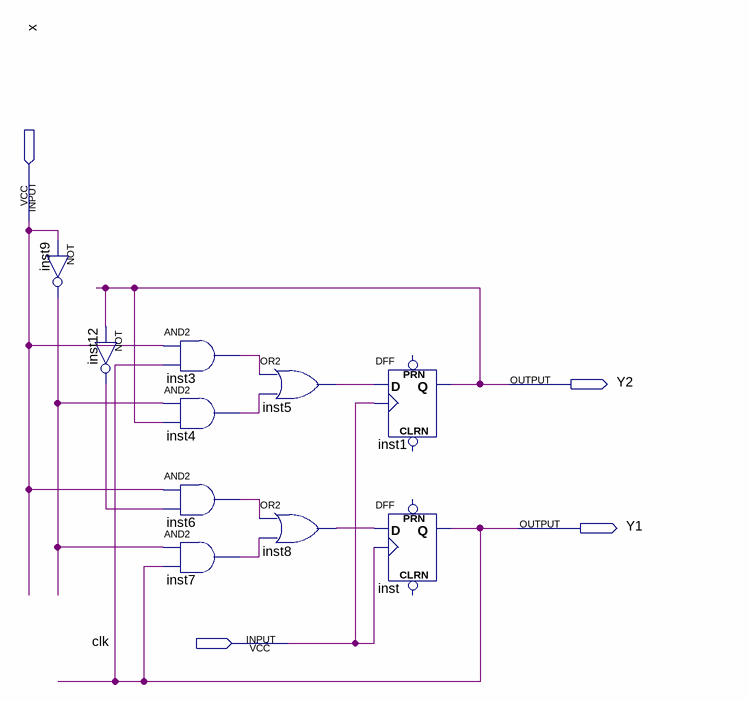
[diagram p0: schematic sheet]
// Quartus schematic Test001.bdf as structural Verilog: 10 symbols, 4 pins
module Test001 (
  input  x,
  input  clk,
  output Y2,
  output Y1
);

  wire inst3_out, inst4_out, inst5_out, inst6_out, inst7_out, inst8_out, inst9_out, inst12_out;

  not inst9 (inst9_out, x);
  not inst12 (inst12_out, Y2);
  and inst3 (inst3_out, x, Y1);
  and inst4 (inst4_out, inst9_out, Y2);
  and inst6 (inst6_out, x, inst12_out);
  and inst7 (inst7_out, inst9_out, Y1);
  or inst5 (inst5_out, inst3_out, inst4_out);
  or inst8 (inst8_out, inst6_out, inst7_out);
  DFF inst1 (.CLK(clk), .D(inst5_out), .Q(Y2));  // open: CLRN, PRN
  DFF inst (.CLK(clk), .D(inst8_out), .Q(Y1));  // open: CLRN, PRN
endmodule
